# EAGLE design Hardware (EAGLE 8.7.0)
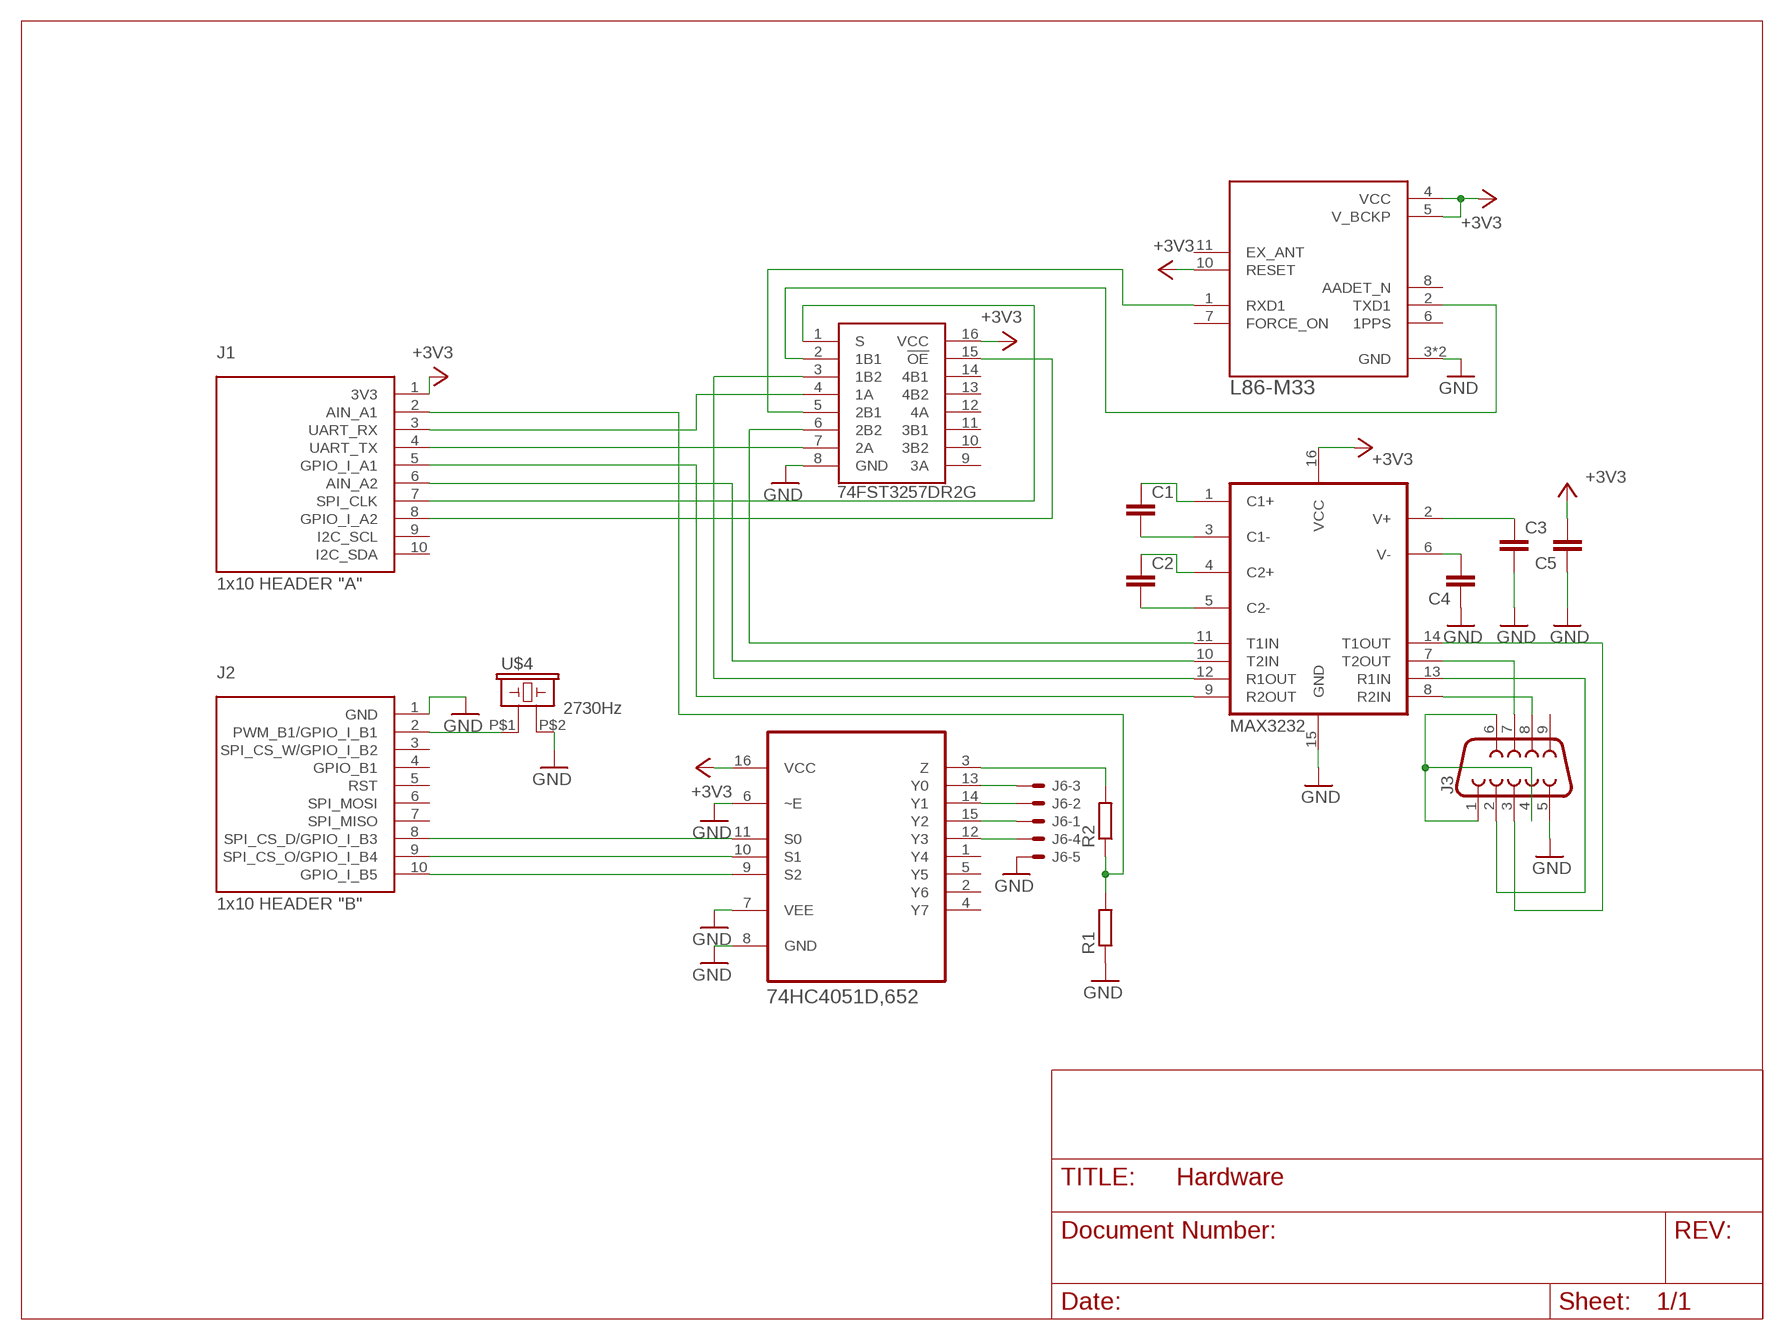
[diagram p0: schematic, sheet 1]

## Parts
C1  C-EUC0805K  [C0805K]
C2  C-EUC0805K  [C0805K]
C3  C-EUC0805K  [C0805K]
C4  C-EUC0805K  [C0805K]
C5  C-EUC0805K  [C0805K]
IC1  74FST3257DR2G  [SOIC127P600X175-16N]
J1  1x10 HEADER "A"  HEADER-1X10-J1  [1X10]
J2  1x10 HEADER "B"  HEADER-1X10-J2  [1X10]
J3  DB9MALE  [DB9_MALE]
J6  22-27-2051-05  [6410-05]
R1  R-EU_0207/7  [0207/7]
R2  R-EU_0207/7  [0207/7]
U1  MAX3232  MAX2323SOIC16  [SO16]
U2  L86-M33  [SON254P1840X1840X40-12N]
U4  74HC4051D,652  [SOIC127P600X175-16N]
U$4  KCVG084B16  [KCVG084B16]

## Nets
+3V3: C5.2 IC1.16(VCC) J1.1(3V3) U1.16(VCC) U2.4(VCC) U2.5(V_BCKP) U2.10(RESET) U4.16(VCC)
GND: C3.2 C4.1 C5.1 IC1.8(GND) J2.1(GND) J3.5 J6.5 R1.1 U1.15(GND) U2.3(GND) U2.12(GND) U4.6(~E) U4.7(VEE) U4.8(GND) U$4.P$2
N$1: C1.1 U1.1(C1+)
N$2: C1.2 U1.3(C1-)
N$3: IC1.4(1A) J1.3(UART_RX)
N$4: C2.1 U1.4(C2+)
N$5: IC1.7(2A) J1.4(UART_TX)
N$6: C3.1 U1.2(V+)
N$7: C4.2 U1.6(V-)
N$8: IC1.2(1B1) U2.2(TXD1)
N$9: C2.2 U1.5(C2-)
N$10: IC1.5(2B1) U2.1(RXD1)
N$11: IC1.3(1B2) U1.12(R1OUT)
N$12: J3.1 J3.4 J3.6
N$13: J3.2 U1.13(R1IN)
N$14: J3.3 U1.14(T1OUT)
N$15: J3.8 U1.8(R2IN)
N$16: J3.7 U1.7(T2OUT)
N$17: IC1.6(2B2) U1.11(T1IN)
N$18: IC1.1(S) J1.7(SPI_CLK)
N$19: IC1.15(!OE) J1.8(GPIO_I_A2)
N$20: J6.3 U4.13(Y0)
N$21: J1.6(AIN_A2) U1.10(T2IN)
N$22: J6.2 U4.14(Y1)
N$23: J6.1 U4.15(Y2)
N$24: J6.4 U4.12(Y3)
N$25: R2.2 U4.3(Z)
N$31: J2.2(PWM_B1/GPIO_I_B1) U$4.P$1
N$43: J1.5(GPIO_I_A1) U1.9(R2OUT)
N$47: J1.2(AIN_A1) R1.2 R2.1
N$49: J2.8(SPI_CS_D/GPIO_I_B3) U4.11(S0)
N$50: J2.9(SPI_CS_O/GPIO_I_B4) U4.10(S1)
N$51: J2.10(GPIO_I_B5) U4.9(S2)
Unconnected: IC1.9(3A) IC1.10(3B2) IC1.11(3B1) IC1.12(4A) IC1.13(4B2) IC1.14(4B1) J1.9(I2C_SCL) J1.10(I2C_SDA) J2.3(SPI_CS_W/GPIO_I_B2) J2.4(GPIO_B1) J2.5(RST) J2.6(SPI_MOSI) J2.7(SPI_MISO) J3.9 U2.6(1PPS) U2.7(FORCE_ON) U2.8(AADET_N) U2.11(EX_ANT) U4.1(Y4) U4.2(Y6) U4.4(Y7) U4.5(Y5)

## Library data of the parts
C1-C5 = rcl:C-EU: CAPACITOR, European symbol; SPICEPREFIX: C
IC1 = 74FST3257DR2G:74FST3257DR2G: 74FST3257DR2G, LOG QUAD 2:1 MULTIPLEXER ON Semiconductor 74FST3257DR2G, Multiplexer Switch IC Quad 2:1 Demultiplexer, 4 5.5 V, 16-Pin SOIC Source: Datasheet <https://componentsearchengine.com/Datasheets/2/74FST3257DR2G.pdf>; DESCRIPTION: 74FST3257DR2G, LOG QUAD 2:1 MULTIPLEXER ON Semiconductor 74FST3257DR2G, Multiplexer Switch IC Quad 2:1 Demultiplexer, 4 5.5 V, 16-Pin SOIC; HEIGHT: 1.75mm; MANUFACTURER_NAME: ON Semiconductor; MANUFACTURER_PART_NUMBER: 74FST3257DR2G; RS_PART_NUMBER: 8009395; RS_PRICE/STOCK: http://uk.rs-online.com/web/p/products/8009395
J1 = CCo-Boost:HEADER-1X10-J1: 1x10 BoosterPack Header J1 This 1x10 header matches the pinout of J1 header of the BoosterPack Pinout Standard.
J2 = CCo-Boost:HEADER-1X10-J2: 1x10 BoosterPack Header J2 This 1x10 header matches the pinout of J2 header of the BoosterPack Pinout Standard.
J3 = SparkFun-Connectors:DB9: DB9 Connector Standard DB9 (D-Sub 9) serial connector. Can be used for CAN bus as well as RS485 and RS232. Footprint production proven. Here is the female version connector we sell at SparkFun: 9 Pin Female Serial Connector - PCB Mount <https://www.sparkfun.com/products/429> (PRT-00429) This connector has been used on the following SparkFun products: SparkFun RS232 Shifter - SMD <https://www.sparkfun.com/products/449> (PRT-00449) SparkFun RS232 Shifter SMD (No DB9) <https://www.sparkfun.com/products/8780> (PRT-08780); PROD_ID: CONN-09904
J6 = con-molex:22-?-05: CONNECTOR wire to board 2.54 mm (.1 inch) pitch header; MF: MOLEX; OC_FARNELL: unknown; OC_NEWARK: unknown
R1 R2 = rcl:R-EU_: RESISTOR, European symbol; SPICEPREFIX: R
U1 = SparkFun-IC-Comms:MAX2323: RS232 Transceiver This part covers 232 drivers that are compatible with the MAX3232. Sipex SP3232EB Datasheet <http://cdn.sparkfun.com/datasheets/Components/General%20IC/SP3232EBCA-L.pdf> SparkFun Products SOIC component <https://www.sparkfun.com/products/589> (COM-00589 / IC-08171) Retired DIP component (COM-00316 / IC-08446) SparkFun Transceiver Breakout - MAX3232 <https://www.sparkfun.com/products/11189> (BOB-11189) SparkFun XBee Explorer Serial <https://www.sparkfun.com/products/13225> (WRL-13225); PROD_ID: IC-08171
U2 = L86-M33:L86-M33: Compact GPS/GLONASS Module with Patch Antenna; AVAILABILITY: Bad; DESCRIPTION: Compact GPS/GLONASS Module with Patch Antenna; MF: Quectel; MP: L86-M33; PACKAGE: LCC-12 Quectel; PRICE: 8.79 USD
U4 = 74HC4051D_652:74HC4051D,652: 8-channel analog multiplexer/demultiplexer; AVAILABILITY: Good; DESCRIPTION: 74HC Series 10 V 8-Channel Analog Multiplexer/Demultiplexer - SOIC-16; MF: Nexperia; MP: 74HC4051D,652; PACKAGE: SO-16 NXP Semiconductors; PRICE: 0.21 USD
U$4 = KCVG084B16:KCVG084B16

## Board
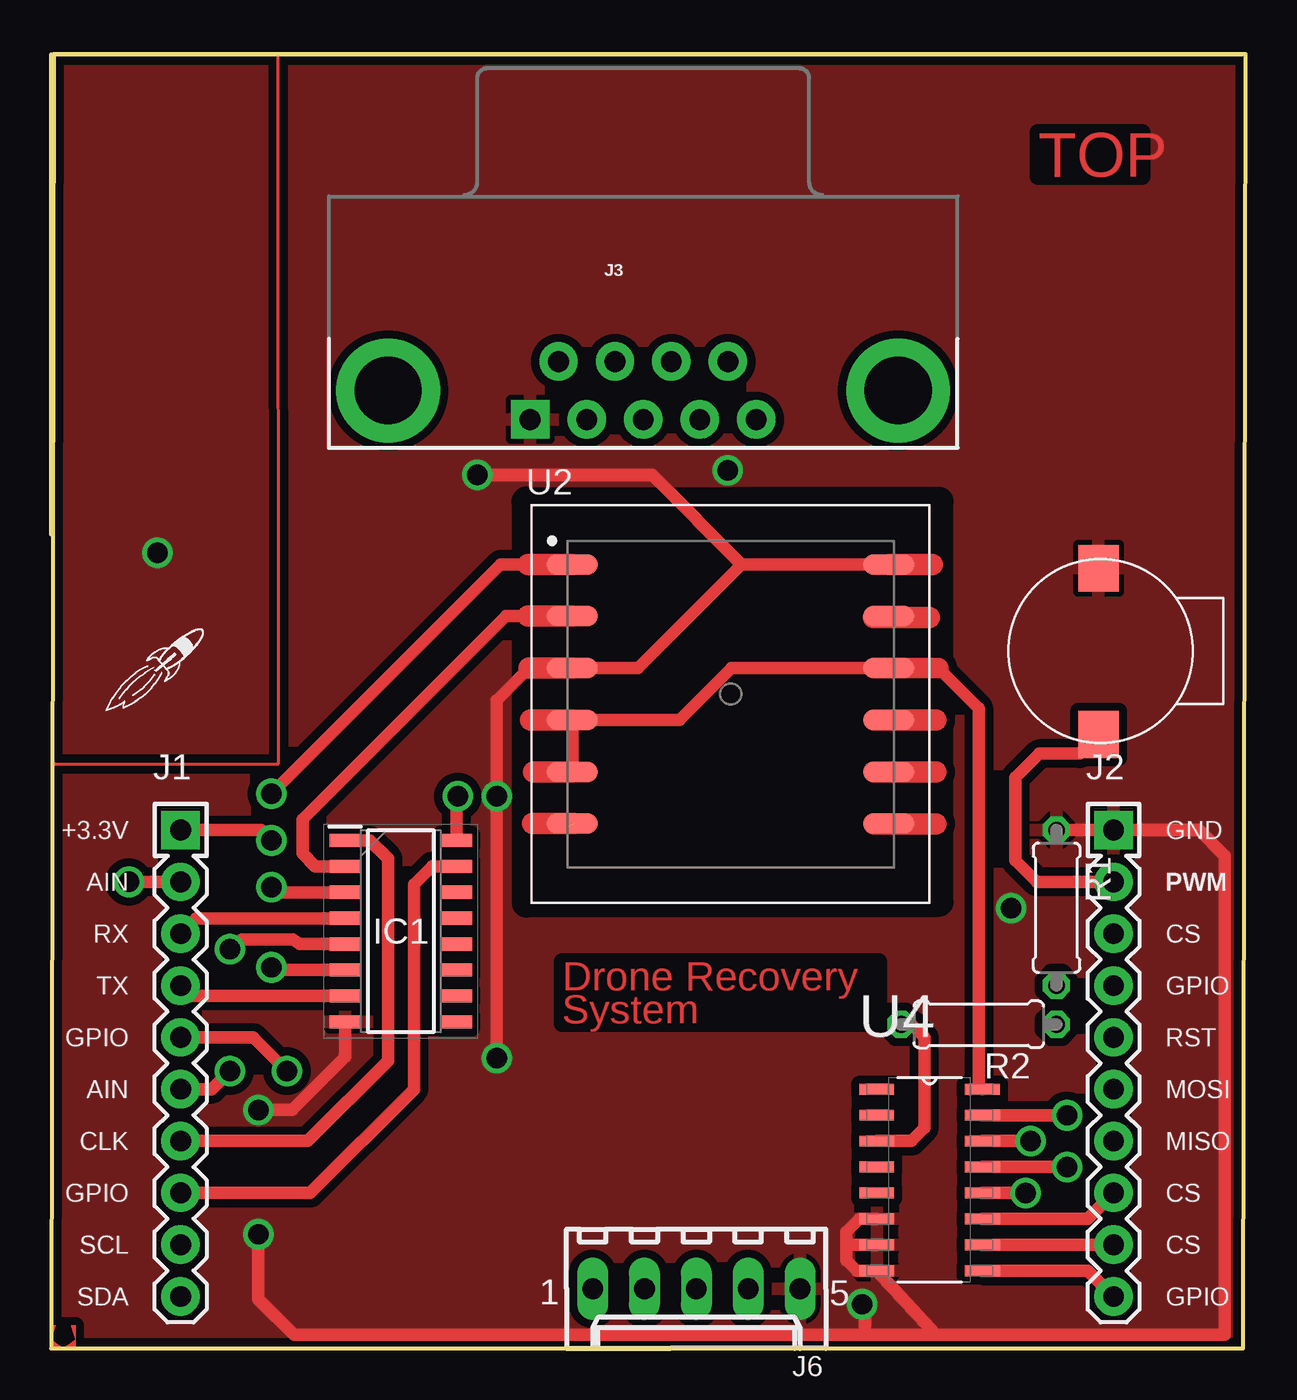
[diagram p1: board, top side]
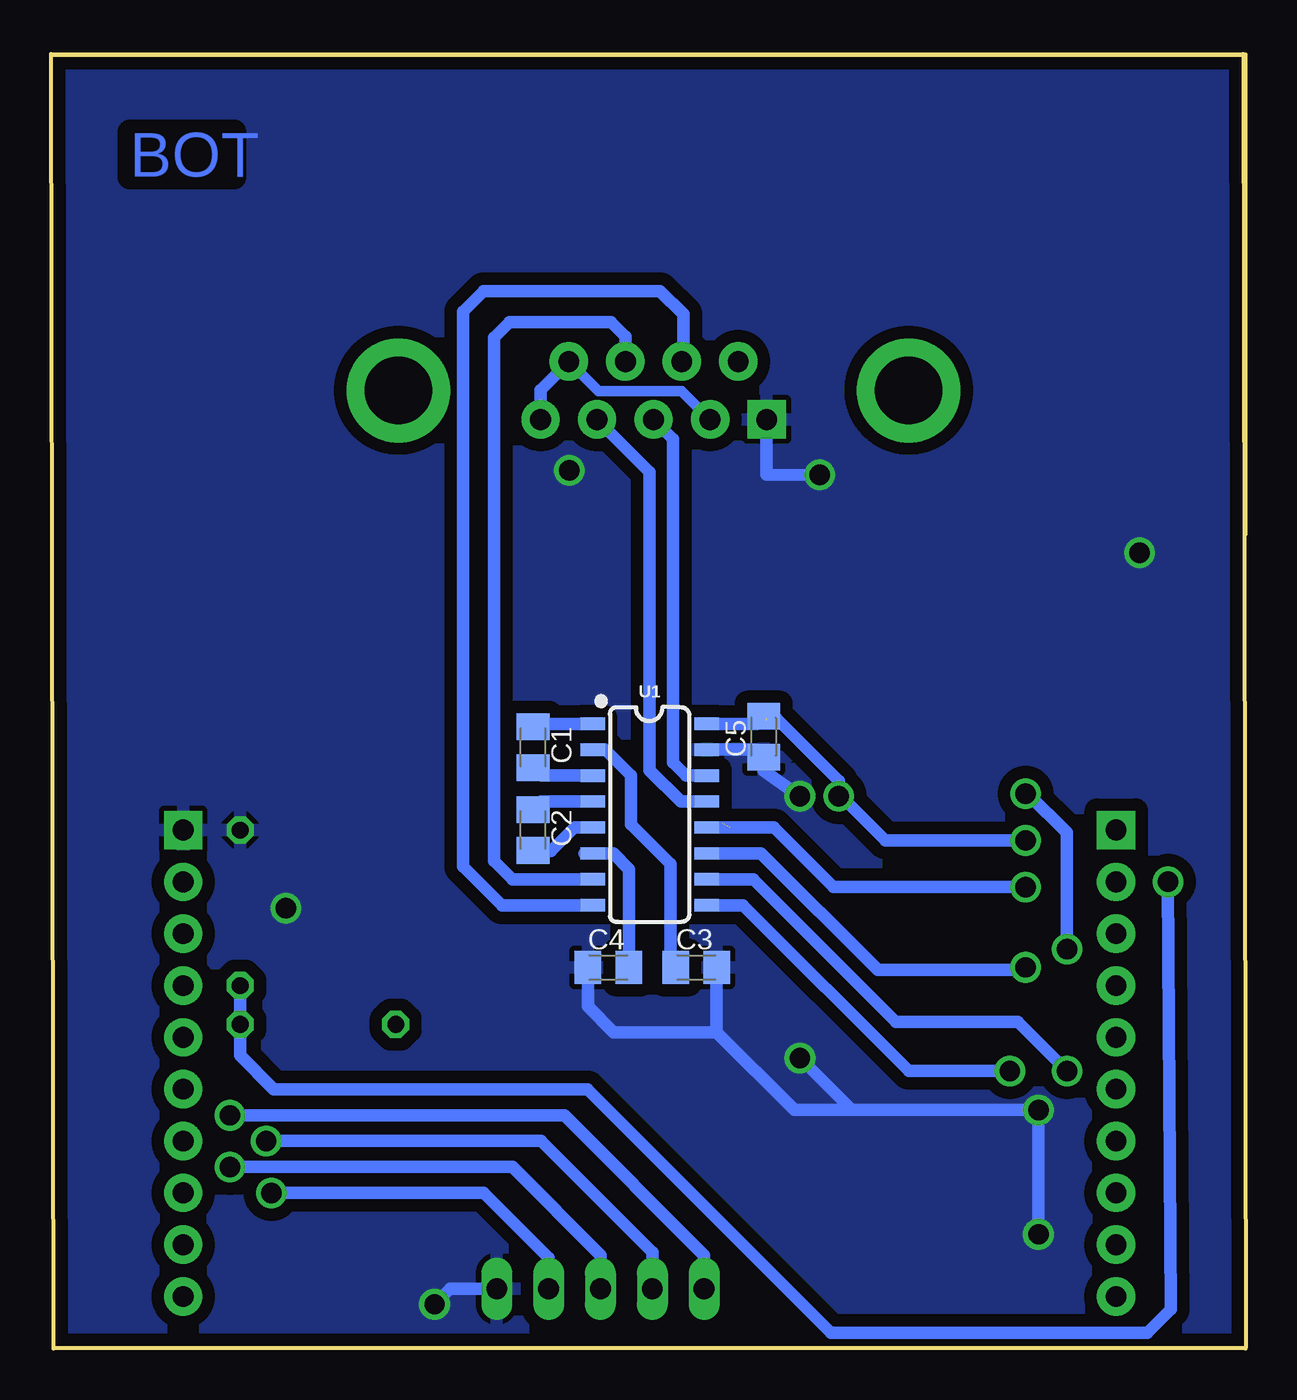
[diagram p2: board, bottom side, seen from below]

Size 58.55 x 63.42 mm. Coordinates in mm from the lower left corner, seen from the top.
Outline: 58.55,63.42 58.42,0 0,0 0.13,63.42 58.55,63.42
Outline: 0,63.4 58.42,63.4 58.55,63.42
Outline: 0.01,39.9 0.01,63.37
Copper layers (1*16): Top 0.035mm / dielectric 1.5mm / Bottom 0.035mm
Design rules "default *": minimum track width 10mil, minimum drill 24mil, track to track 12mil, track to pad 12mil, pad to pad 12mil, via to via 12mil, smd to smd 8mil, copper to edge 10mil, drill to drill 8mil, minimum pad ring 10mil, minimum via ring 8mil, stop-mask expansion 4mil, vias tented up to drill 0mil, thermal gap 10mil
bKeepout: area 29.1,34.4 to 51.1,39.4
tRestrict: area 23.3,21.8 to 43.5,41.5

### Footprints (pad centres in the part's own frame; a part is rotated, then mirrored left to right if it is on the bottom)
C0805K = smd 1.3 x 1.6: 1 -1,0; 2 1,0
SOIC127P600X175-16N = smd 1.55 x 0.65: 1 -2.725,4.445; 2 -2.725,3.175; 3 -2.725,1.905; 4 -2.725,0.635; 5 -2.725,-0.635; 6 -2.725,-1.905; 7 -2.725,-3.175; 8 -2.725,-4.445; 9 2.725,-4.445; 10 2.725,-3.175; 11 2.725,-1.905; 12 2.725,-0.635; 13 2.725,0.635; 14 2.725,1.905; 15 2.725,3.175; 16 2.725,4.445
1X10 = drill 1.016 pad 1.88 square: 1 0,10.16 | drill 1.016 pad 1.88: 2 0,7.62; 3 0,5.08; 4 0,2.54; 5 0,0; 6 0,-2.54; 7 0,-5.08; 8 0,-7.62; 9 0,-10.16; 10 0,-12.7
DB9_MALE = drill 1.016 pad 1.88: 1 5.54,-1.42; 2 2.77,-1.42; 3 0,-1.42; 4 -2.77,-1.42; 6 4.15,1.42; 7 1.38,1.42; 8 -1.38,1.42; 9 -4.15,1.42 | drill 1.016 pad 1.88 square: 5 -5.54,-1.42 | drill 3.302 pad 5.08: G1 -12.5,0; G2 12.5,0
6410-05 = drill 1.016 long: 1 5.08,0; 2 2.54,0; 3 0,0; 4 -2.54,0; 5 -5.08,0
0207/7 = drill 0.813 octagon: 1 -3.81,0; 2 3.81,0
SO16 = smd 0.6 x 1.2: 1 -4.445,-2.8; 2 -3.175,-2.8; 3 -1.905,-2.8; 4 -0.635,-2.8; 5 0.635,-2.8; 6 1.905,-2.8; 7 3.175,-2.8; 8 4.445,-2.8; 9 4.445,2.8; 10 3.175,2.8; 11 1.905,2.8; 12 0.635,2.8; 13 -0.635,2.8; 14 -1.905,2.8; 15 -3.175,2.8; 16 -4.445,2.8
SON254P1840X1840X40-12N = smd 2.5 x 1: 1 -7.75,6.35; 2 -7.75,3.81; 3 -7.75,1.27; 4 -7.75,-1.27; 5 -7.75,-3.81; 6 -7.75,-6.35; 7 7.75,-6.35; 8 7.75,-3.81; 9 7.75,-1.27; 10 7.75,1.27; 11 7.75,3.81; 12 7.75,6.35
SOIC127P600X175-16N' = smd 1.702 x 0.533: 1 -2.591,4.445; 2 -2.591,3.175; 3 -2.591,1.905; 4 -2.591,0.635; 5 -2.591,-0.635; 6 -2.591,-1.905; 7 -2.591,-3.175; 8 -2.591,-4.445; 9 2.591,-4.445; 10 2.591,-3.175; 11 2.591,-1.905; 12 2.591,-0.635; 13 2.591,0.635; 14 2.591,1.905; 15 2.591,3.175; 16 2.591,4.445
KCVG084B16 = smd 2.3 x 2: P$1 -4.1,0.1; P$2 4.05,0.1

### Placement (x,y rotation side)
C1  34.92,29.46 270 bottom
C2  34.92,25.4 270 bottom
C3  26.92,18.67 0 bottom
C4  31.24,18.67 0 bottom
C5  23.62,29.97 90 bottom
IC1  17.14,20.45 0 top
J1  6.35,15.24 0 top
J2  52.07,15.24 0 top
J3  29.02,46.94 0 top
J6  31.62,2.92 180 top
R1  49.28,21.59 270 top
R2  45.47,15.88 180 top
U1  29.21,26.16 270 bottom
U2  33.3,32.07 0 top
U4  74HC4051D,652  [SOIC127P600X175-16N']  43.05,8.26 0 top
U$1  [LOGO-ROCKET]  5.23,33.43 0 top
U$2  [METRIC_15]  0,0 180 bottom
U$3  [METRIC_15]  0,0 90 top
U$4  51.44,34.18 90 top

### Tracks (layer width: path | path; a pad name or v marks a point on that pad's centre or on a via)
+3V3  (via drill 1)  (1 unrouted)
  Top 0.61: J1.1 10.29,25.4 v10.79,24.89 | IC1.16 19.87,26.98 v19.94,27.05 | U2.10 33.34,33.34 30.8,30.8 U2.4 U2.5 | 43.48,33.34 45.46,31.36 45.46,12.88 U4.16
  Top 1.016: U2.10 43.48,33.34
  Top 1.041: U2.4 23.51,30.8 | U2.5 23.65,28.26
  Bottom 0.61: U1.16 23.99,30.61 C5.2 23.51,30.86 22.99,30.86 19.94,27.81 v19.94,27.05 19.81,27.05 17.65,24.89 v10.79,24.89
CUT
  Top 0.152: 0.17,28.65 11.15,28.64 11.12,63.42
GND  (via drill 1)
  Top 0.61: 43.36,0.66 U4.8 39.5,3.81 38.99,4.32 38.99,5.08 | 43.36,0.66 57.53,0.66 57.53,24.13 56.26,25.4 J2.1 R1.1 | 39.88,0.66 11.91,0.66 10.16,2.41 v10.16,5.59 | 39.88,0.66 43.36,0.66 | U2.3 28.77,33.34 33.85,38.42 | 33.85,38.42 U2.12 | v20.88,42.8 29.46,42.8 33.85,38.42 | v39.75,2.16 39.88,2.03 39.88,0.66 | 23.43,33.34 21.84,31.75 v21.84,27.05 v21.84,14.22 | IC1.8 14.42,14.29 11.81,11.68 v10.16,11.68 | U4.6 39.62,6.35 38.99,5.71 38.99,5.08 | U4.7 38.99,5.08
  Top 1.041: U2.3 23.43,33.34 | U2.12 43.18,38.42
  Bottom 0.61: 19.3,11.68 v10.16,11.68 v10.16,5.59 | 19.3,11.68 22.11,11.68 25.92,15.49 | U1.15 23.99,29.34 C5.1 23.62,28.32 v21.84,27.05 | 25.92,15.49 C3.2 | J3.5 23.48,42.81 v20.88,42.8 | C4.1 32.24,16.75 30.99,15.49 25.92,15.49 | v39.75,2.16 38.99,2.92 J6.5 | v21.84,14.22 19.3,11.68
  other vias: 5.21,38.99 33.16,43.02 47.04,21.57
  pour Top (isolate 0.406): 0,0 0,63.37 58.55,63.37 58.55,0
  pour Bottom (isolate 0.61): 0,0 58.55,0 58.55,63.37 0,63.37
N$1
  Bottom 0.61: 35.29,30.61 C1.1 34.78,30.61 U1.1
N$2
  Bottom 0.61: U1.3 34.53,28.07 C1.2
N$3
  Top 0.61: IC1.4 7.11,21.08 J1.3
N$4
  Bottom 0.61: U1.4 34.53,26.8 C2.1
N$5
  Top 0.61: IC1.7 6.86,17.27 J1.4
N$6
  Bottom 0.61: C3.1 28.19,18.94 28.19,23.75 30.12,25.68 30.12,28.07 31.39,29.34 U1.2
N$7
  Bottom 0.61: 32.4,24.26 U1.6 | 31.37,24.26 U1.6 | U1.6 30.99,24.26 30.21,23.48 30.21,18.7 C4.2
N$8
  Top 0.61: IC1.2 12.95,23.62 12.32,24.26 12.32,25.91 22.29,35.88 23.37,35.88
  Top 1.041: U2.2 23.37,35.88
N$9
  Bottom 0.61: U1.5 32.89,25.53 34.04,24.38 34.91,24.38 C2.2
N$10  (via drill 1)
  Top 0.61: IC1.5 12.19,19.81 11.84,20.04 9.37,20.04 v8.76,19.56 | 23.37,38.42 22.04,38.42 v10.79,27.18
  Top 1.041: U2.1 23.37,38.42
  Bottom 0.61: v8.76,19.56 8.76,25.27 10.67,27.18 v10.79,27.18
N$11  (via drill 1)  (1 unrouted)
  Top 0.61: IC1.3 11.05,22.35 v10.79,22.61
  Top 1.041: 25.64,25.72 23.61,25.72
  Bottom 0.61: v10.79,22.61 17.65,22.61 20.19,22.61 23.11,25.53 25.27,25.53 U1.12
N$12
  Bottom 0.508: J3.6 31.73,46.92 27.65,46.92 J3.4
  Bottom 0.61: J3.6 34.56,46.97 J3.1
N$13
  Bottom 0.61: U1.13 27.69,26.8 29.21,28.32 29.21,42.94 J3.2
N$14
  Bottom 0.61: U1.14 27.43,28.07 28.07,28.7 28.07,44.57 J3.3
N$15
  Bottom 0.61: J3.8 27.56,48.44 27.56,50.67 28.7,51.82 37.34,51.82 38.35,50.8 38.35,23.62 36.45,21.72 U1.8
N$16
  Bottom 0.61: J3.7 30.4,49.58 31.11,50.29 36.07,50.29 36.83,49.53 36.83,23.88 35.94,22.99 U1.7
N$17  (via drill 1)
  Top 0.61: v10.79,18.67 10.92,18.54 IC1.6
  Bottom 0.61: U1.11 23.75,24.26 18.03,18.54 10.92,18.54 v10.79,18.67
N$18
  Top 0.61: IC1.1 15.62,24.89 16.51,24 16.51,14.1 12.57,10.16 J1.7
N$19
  Top 0.61: IC1.15 18.67,23.62 17.78,22.73 17.78,12.7 12.7,7.62 J1.8
N$20  (via drill 1)
  Top 0.61: U4.13 v49.78,8.89
  Bottom 0.61: v49.78,8.89 35.94,8.89 31.62,4.57 J6.3
N$21  (via drill 1)
  Top 0.61: J1.6 7.87,12.7 v8.76,13.59
  Bottom 0.61: U1.10 24.13,22.99 17.14,16 11.18,16 v8.76,13.59
N$22  (via drill 1)
  Top 0.61: v48.01,10.16 U4.14
  Bottom 0.61: v48.01,10.16 34.54,10.16 29.08,4.7 J6.2
N$23  (via drill 1)
  Top 0.61: U4.15 v49.77,11.43 v49.78,11.42
  Bottom 0.61: v49.78,11.42 33.39,11.42 26.54,4.57 J6.1
N$24  (via drill 1)
  Top 0.61: v47.75,7.62 U4.12
  Bottom 0.61: v47.75,7.62 37.34,7.62 34.16,4.45 J6.4
N$25
  Top 0.61: U4.3 42.16,10.16 42.8,10.79 42.8,15.24 42.16,15.88 R2.2
N$27
  Top 1.041: 40.3,35.82 43.05,35.82
N$28
  Top 1.041: 40.32,30.79 43.37,30.79
N$29
  Top 1.041: 40.32,28.25 43.37,28.25
N$30
  Top 1.041: 40.32,25.7 43.37,25.7
N$31
  Top 0.61: J2.2 48.31,22.86 47.26,23.91 47.26,27.98 48.43,29.15 50.41,29.15 U$4.P$1
N$43  (via drill 1)
  Top 0.61: J1.5 9.91,15.24 v11.56,13.59
  Bottom 0.61: U1.9 24.64,21.72 16.51,13.59 v11.56,13.59
N$47  (via drill 1)
  Top 0.61: J1.2 v3.81,22.86
  Bottom 0.61: v3.81,22.86 3.68,1.91 4.83,0.76 20.32,0.76 32.26,12.7 47.62,12.7 49.28,14.35 R2.1 R1.2
N$49
  Top 0.61: U4.11 50.8,6.35 J2.8
N$50
  Top 0.61: J2.9 U4.10
N$51
  Top 0.61: U4.9 50.8,3.81 J2.10
(copper drawn outside any net)
  shapes: Top area x2254

### Text on the board
Top: TOP | Drone Recovery / System | D:/Users/Marius/Documents/Strathclyde/EE318/University_of_Strathclyde_Coat_of_Arms.bmp
Bottom: BOT
tPlace: +3.3V | GND | AIN | PWM | RX | CS | TX | GPIO | GPIO | RST | AIN | MOSI | CLK | MISO | GPIO | CS | SCL | CS | SDA | GPIO